# EAGLE schematic A_Shield (EAGLE 9.3.0)
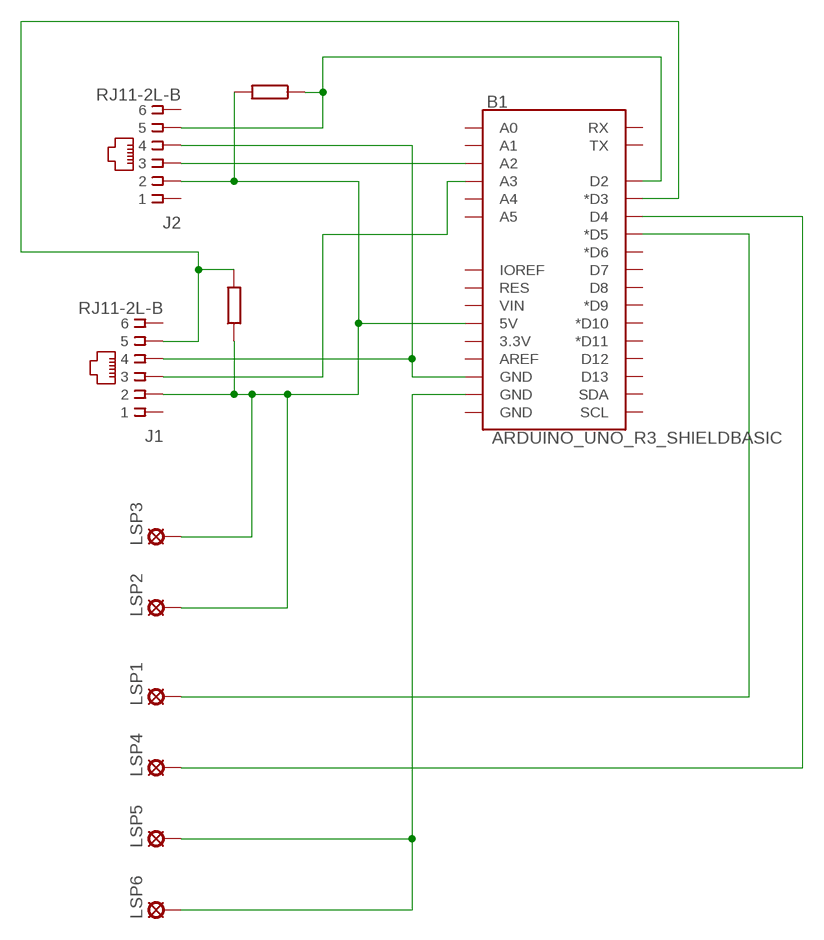
[diagram p0: schematic, sheet 1]

## Parts
B1  ARDUINO_UNO_R3_SHIELDBASIC  [UNO_R3_SHIELD]
J1  RJ11-2L-B  [RJ11-NO_SHIELD]
J2  RJ11-2L-B  [RJ11-NO_SHIELD]
LSP1  LSP13  [LSP13]
LSP2  LSP13  [LSP13]
LSP3  LSP13  [LSP13]
LSP4  LSP13  [LSP13]
LSP5  LSP13  [LSP13]
LSP6  LSP13  [LSP13]

## Nets
N$1: B1.5V J1.2 J2.2 LSP2.MP LSP3.MP
N$2: B1.GND@2(GND) J1.4 J2.4
N$3: B1.D3(*D3) J1.5
N$4: B1.D2 J2.5
N$5: B1.A3 J1.3
N$6: B1.A2 J2.3
N$7: B1.GND@1(GND) LSP5.MP LSP6.MP
N$8: B1.D5(*D5) LSP1.MP
N$9: B1.D4 LSP4.MP
Unconnected: B1.3.3V B1.A0 B1.A1 B1.A4 B1.A5 B1.AREF B1.D6(*D6) B1.D7 B1.D8 B1.D9(*D9) B1.D10(*D10) B1.D11(*D11) B1.D12 B1.D13 B1.GND@0(GND) B1.IOREF B1.RES B1.RX B1.SCL B1.SDA B1.TX B1.VIN J1.1 J1.6 J2.1 J2.6

## Library data of the parts
B1 = SparkFun-Boards:ARDUINO_UNO_R3_SHIELD: Arduino R3 Shield Footprint Shield form compatible with the Arduino Uno R3. SparkFun Products: MG2639 Cellular Shield <https://www.sparkfun.com/products/13120> MIDI Shield <https://www.sparkfun.com/products/12898> R3 Stackable Headers Kit <https://www.sparkfun.com/products/11417>
J1 J2 = con-tycoelectronics:RJ11: CORCOM Modular RJ Jacks No Shield Source: www.tycoelectronics.com .. ENG_DS_1654001_1099_RJ_L_0507.pdf; MF: TYCO ELECTRONICS; MPN: RJ11-2L-B; OC_FARNELL: unknown; OC_NEWARK: 83F4463
LSP1-LSP6 = solpad:LSP13: SOLDER PAD drill 1.3 mm, distributor Buerklin, 12H562